# Altium schematic sheet main_sheet.SchDoc
size A3
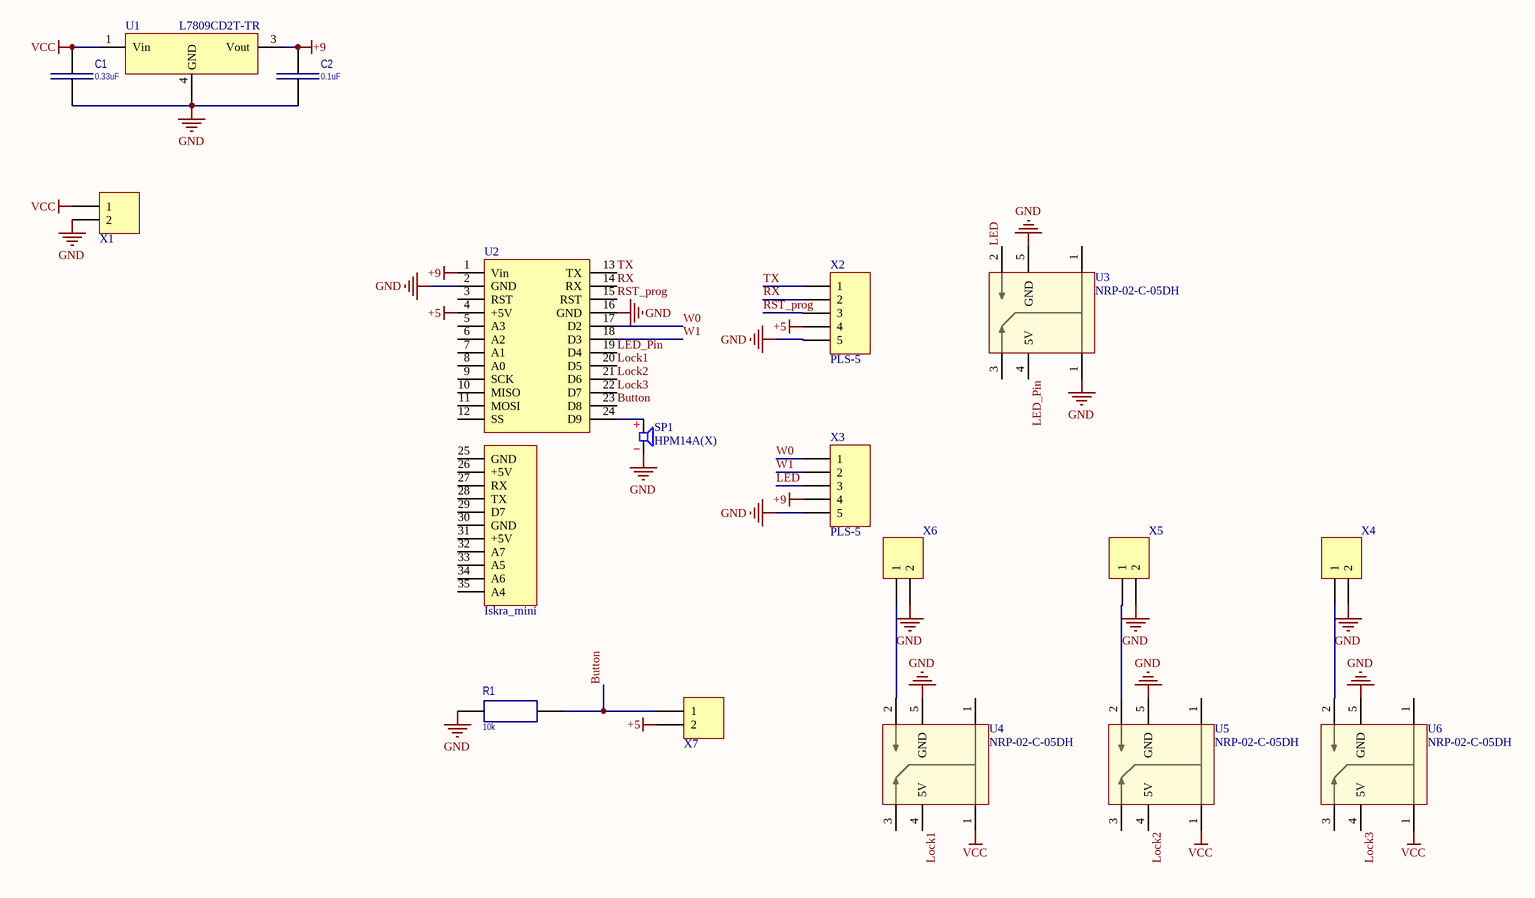
[diagram p0: main_sheet.SchDoc]

## Parts
C1  0.33uF  [C_0805]
C2  0.1uF  [C_0805]
R1  10k  [R_0805]
SP1  HPM14A(X)  [Beeper_14x7.5]
U1  L7809CD2T-TR  [*VREG_L7805ACD2T]
U2  Iskra_mini  [ISKRA_MINI_L]
U3  NRP-02-C-05DH  [Relay 5V]
U4  NRP-02-C-05DH  [Relay 5V]
U5  NRP-02-C-05DH  [Relay 5V]
U6  NRP-02-C-05DH  [Relay 5V]
X1  PLS-2  [DG142R-5.08-02P-14]  (value not drawn)
X2  PLS-5  [PLS-5-3D]
X3  PLS-5  [PLS-5-3D]
X4  PLS-2  [DG142R-5.08-02P-14]  (value not drawn)
X5  PLS-2  [DG142R-5.08-02P-14]  (value not drawn)
X6  PLS-2  [DG142R-5.08-02P-14]  (value not drawn)
X7  PLS-2  [PLS-2-3D]  (value not drawn)

## Nets
+5: U2.4(+5V) X2.4 X7.2
+9: C2.2 U1.3(Vout) U2.1(Vin) X3.4
GND: C1.1 C2.1 R1.1 SP1.2(-) U1.4(GND) U2.2(GND) U2.16(GND) U3.1 U3.5(GND) U4.5(GND) U5.5(GND) U6.5(GND) X1.2 X2.5 X3.5 X4.2 X5.2 X6.2
VCC: C1.2 U1.1(Vin) U4.1 U5.1 U6.1 X1.1
Button: R1.2 U2.23(D8) X7.1
LED: U3.2 X3.3
LED_Pin: U2.19(D4) U3.4(5V)
Lock1: U2.20(D5) U4.4(5V)
Lock2: U2.21(D6) U5.4(5V)
Lock3: U2.22(D7) U6.4(5V)
RST_prog: U2.15(RST) X2.3
RX: U2.14(RX) X2.2
TX: U2.13(TX) X2.1
W0: U2.17(D2) X3.1
W1: U2.18(D3) X3.2
NetSP1_1: SP1.1(+) U2.24(D9)
NetU4_2: U4.2 X6.1
NetU5_2: U5.2 X5.1
NetU6_2: U6.2 X4.1

Not connected (* = marked no-connect by the designer): U2 3(RST) 5(A3) 6(A2) 7(A1) 8(A0) 9(SCK) 10(MISO) 11(MOSI) 12(SS) 25(GND) 26(+5V) 27(RX) 28(TX) 29(D7) 30(GND) 31(+5V) 32(A7) 33(A5) 34(A6) 35(A4); U3 3; U4 3; U5 3; U6 3

## Library data of the parts
C1 C2 = C0805: Capacitor
  C1: Value: 0.33uF
  C2: Value: 0.1uF
R1 = R0805: Resistor; Value: 10k
SP1 = HPM14A(X): Speaker with (AX)/without (A) frequency grnerator
U3-U6 = Relay
X1 X4-X7 = PLS-2: Header, 2-Pin; LatestRevisionDate: 17-Jul-2002; LatestRevisionNote: Re-released for DXP Platform.; Publisher: Altium Limited
X2 X3 = PLS-5: Header, 5-Pin; LatestRevisionDate: 17-Jul-2002; LatestRevisionNote: Re-released for DXP Platform.; Publisher: Altium Limited